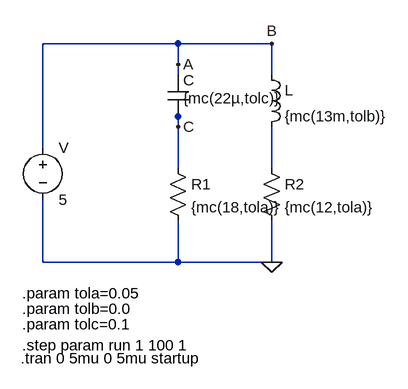
[diagram p0: schematic Montecarlo.asc]
Montecarlo.asc, the LTspice schematic file:
Version 4
SHEET 1 880 680
WIRE 272 0 64 0
WIRE 416 0 272 0
WIRE 272 32 272 0
WIRE 272 48 272 32
WIRE 416 48 416 0
WIRE 272 112 272 96
WIRE 272 128 272 112
WIRE 64 160 64 0
WIRE 272 192 272 128
WIRE 416 192 416 128
WIRE 64 336 64 240
WIRE 272 336 272 272
WIRE 272 336 64 336
WIRE 416 336 416 272
WIRE 416 336 272 336
FLAG 416 336 0
FLAG 416 0 B
FLAG 272 128 C
FLAG 272 32 A
SYMBOL voltage 64 144 R0
WINDOW 123 0 0 Left 0
WINDOW 39 0 0 Left 0
SYMATTR InstName V
SYMATTR Value 5
SYMBOL res 256 176 R0
SYMATTR InstName R1
SYMATTR Value {mc(18,tola)}
SYMBOL ind 400 32 R0
SYMATTR InstName L
SYMATTR Value {mc(13m,tolb)}
SYMBOL res 400 176 R0
SYMATTR InstName R2
SYMATTR Value {mc(12,tola)}
SYMBOL cap 256 48 R0
WINDOW 3 24 36 Left 2
SYMATTR Value {mc(22µ,tolc)}
SYMATTR InstName C
TEXT 32 384 Left 2 !.param tola=0.05
TEXT 32 408 Left 2 !.param tolb=0.0
TEXT 32 432 Left 2 !.param tolc=0.1
TEXT 32 464 Left 2 !.step param run 1 100 1
TEXT 30 484 Left 2 !.tran 0 5mu 0 5mu startup

The netlist it stands for:
* Montecarlo.asc
V A 0 5
R1 C 0 {mc(18,tola)}
L A N001 {mc(13m,tolb)}
R2 N001 0 {mc(12,tola)}
C A C {mc(22µ,tolc)}
.param tola=0.05
.param tolb=0.0
.param tolc=0.1
.step param run 1 100 1
.tran 0 5mu 0 5mu startup
.backanno
.end